# Altium schematic sheet NTC.SchDoc
size 420 x 297 mm; SheetNumber: 20; SheetTotal: 27
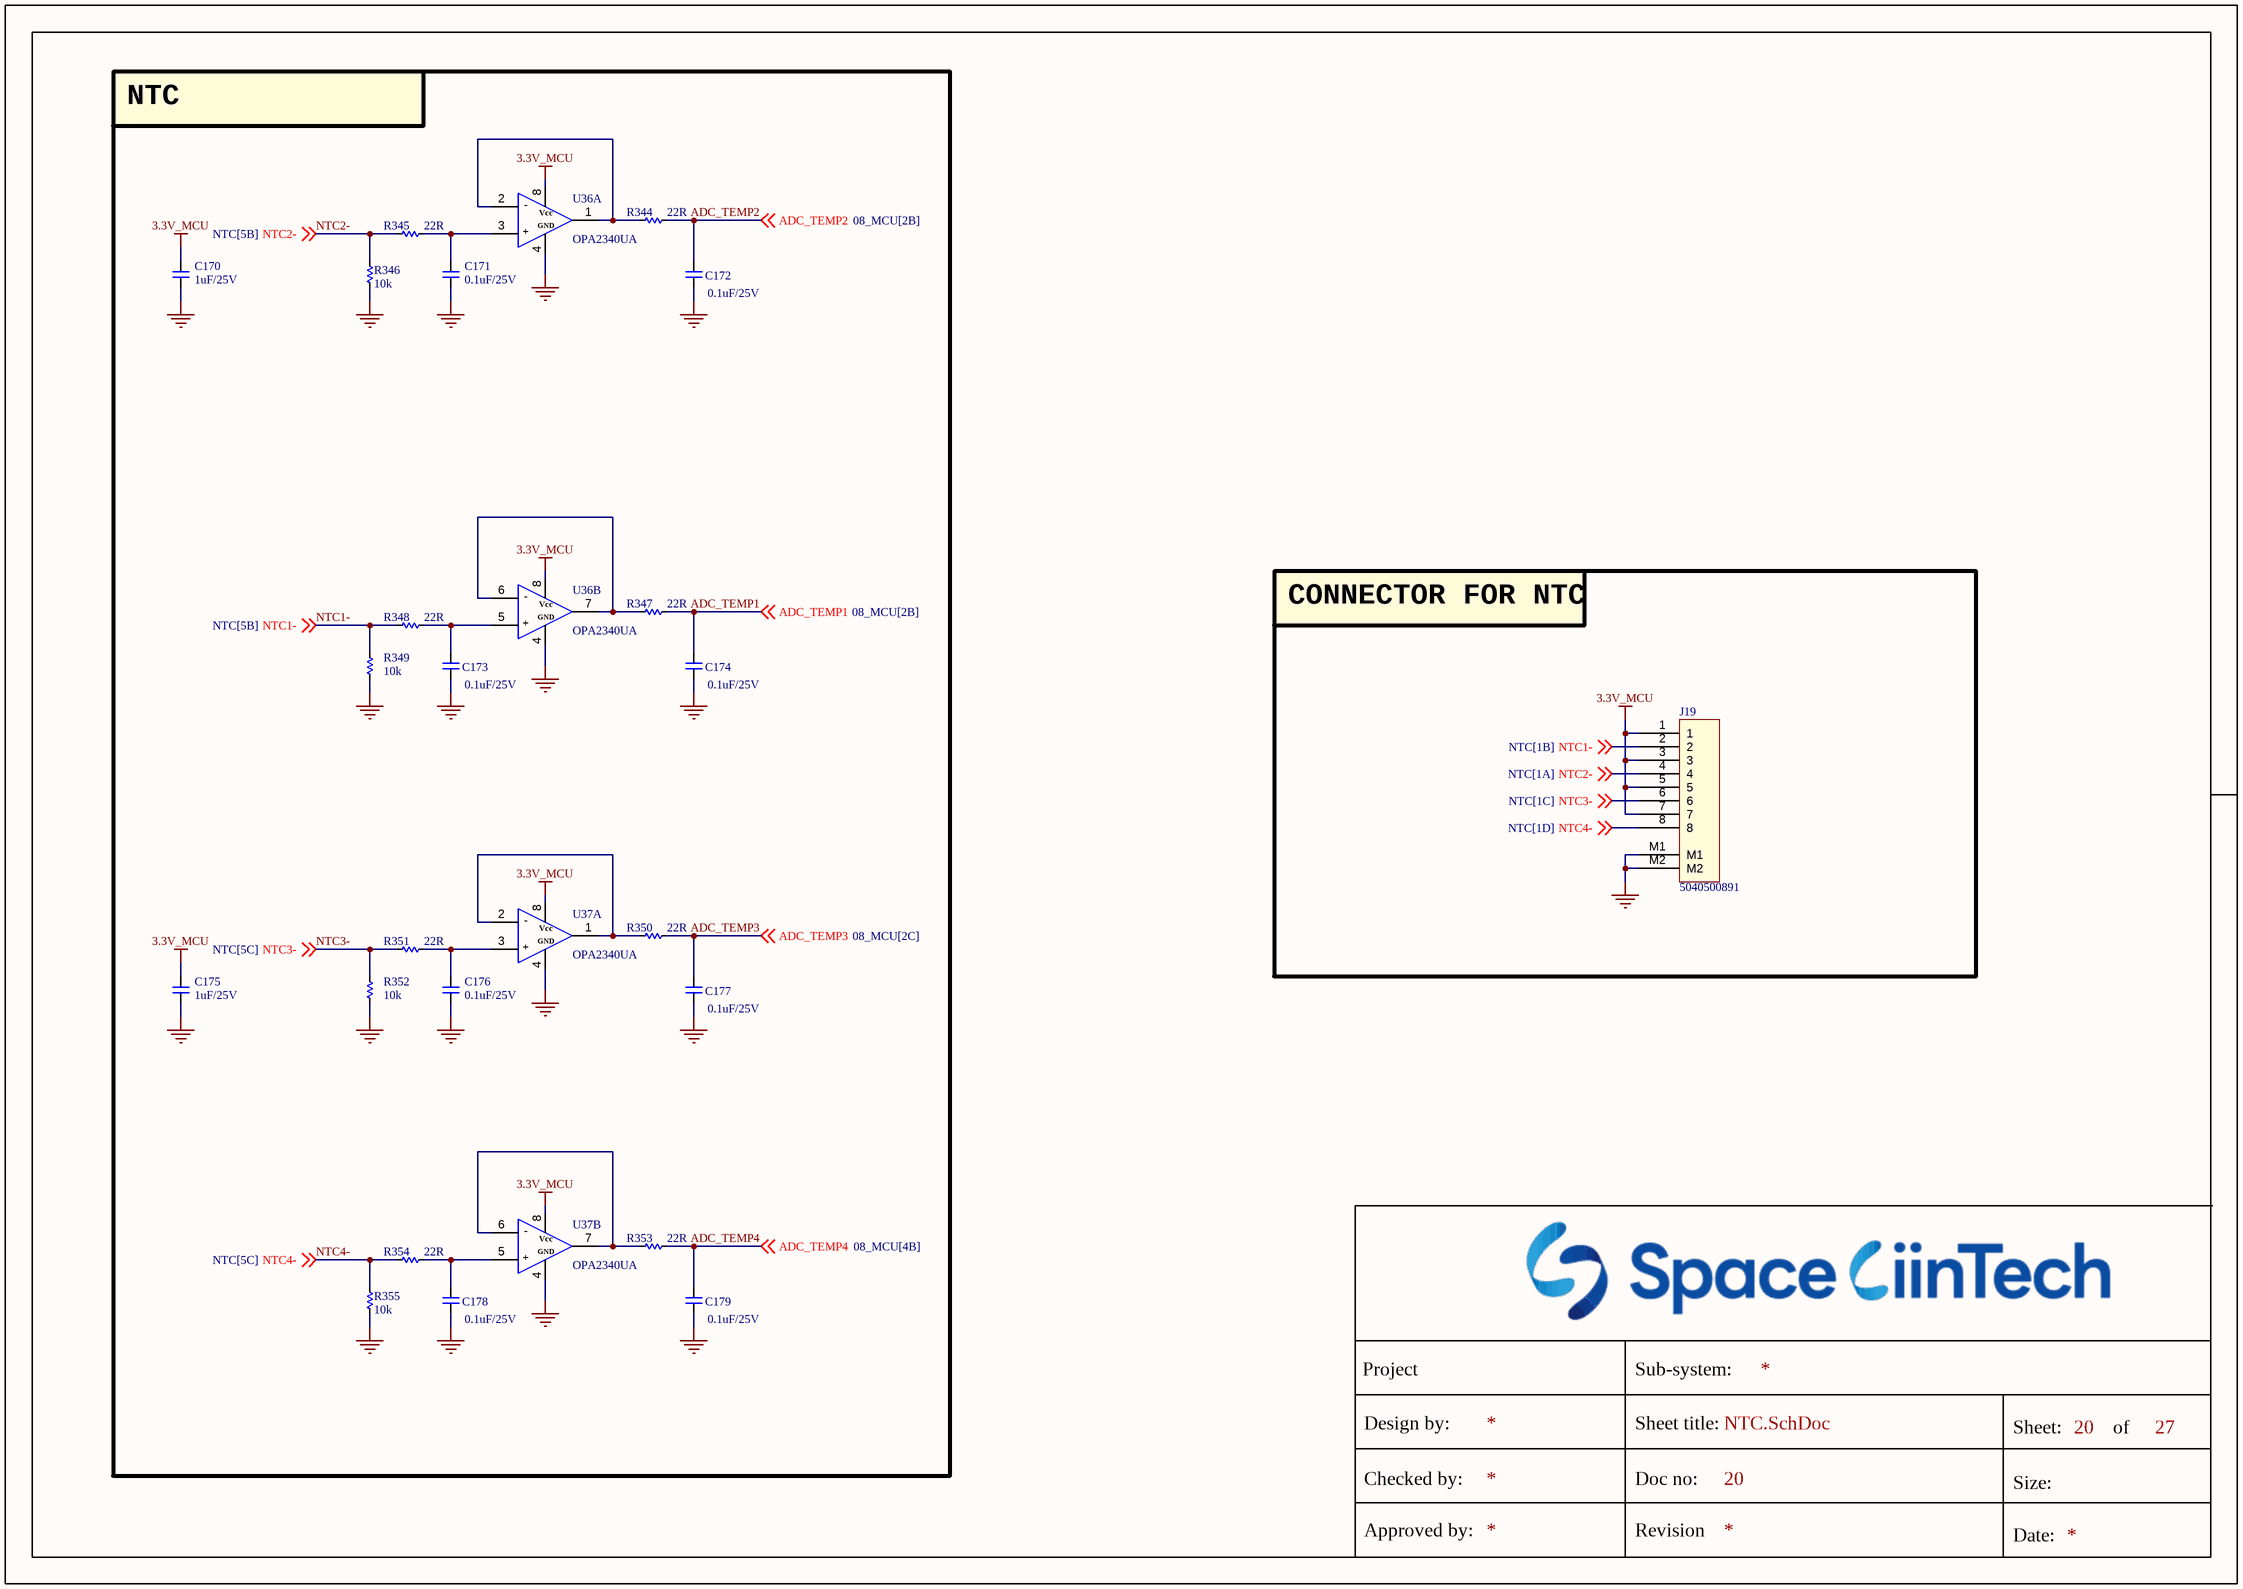
[diagram p0: NTC.SchDoc]

## Parts
C170  1uF/25V  [CAP_C_1005X60]
C171  0.1uF/25V  [CAP_C_1005X60]
C172  0.1uF/25V  [CAP_C_1005X60]
C173  0.1uF/25V  [CAP_C_1005X60]
C174  0.1uF/25V  [CAP_C_1005X60]
C175  1uF/25V  [CAP_C_1005X60]
C176  0.1uF/25V  [CAP_C_1005X60]
C177  0.1uF/25V  [CAP_C_1005X60]
C178  0.1uF/25V  [CAP_C_1005X60]
C179  0.1uF/25V  [CAP_C_1005X60]
J19  5040500891  [MOLEX_5040500891]
R344  22R  [RES_C_1005X40]
R345  22R  [RES_C_1005X40]
R346  10k  [RES_C_1005X40]
R347  22R  [RES_C_1005X40]
R348  22R  [RES_C_1005X40]
R349  10k  [RES_C_1005X40]
R350  22R  [RES_C_1005X40]
R351  22R  [RES_C_1005X40]
R352  10k  [RES_C_1005X40]
R353  22R  [RES_C_1005X40]
R354  22R  [RES_C_1005X40]
R355  10k  [RES_C_1005X40]
U36  OPA2340UA  [SOIC127P602X173-8N]  (parts A,B of 2)
U37  OPA2340UA  [SOIC127P602X173-8N]  (parts A,B of 2)

## Blocks framed on the sheet
NTC: C170-C179 R344-R355 U36 U37
CONNECTOR FOR NTC: J19

## Nets
3.3V_MCU: C170.2 C175.2 J19.1 J19.3 J19.5 J19.7 U36.8 U37.8
GND: C170.1 C171.1 C172.1 C173.1 C174.1 C175.1 C176.1 C177.1 C178.1 C179.1 J19.M1 J19.M2 R346.1 R349.1 R352.1 R355.1 U36.4 U37.4
ADC_TEMP1: C174.2 R347.2 ; off-sheet ADC_TEMP1
ADC_TEMP2: C172.2 R344.2 ; off-sheet ADC_TEMP2
ADC_TEMP3: C177.2 R350.2 ; off-sheet ADC_TEMP3
ADC_TEMP4: C179.2 R353.2 ; off-sheet ADC_TEMP4
NTC1-: J19.2 R348.1 R349.2 ; off-sheet NTC1-
NTC2-: J19.4 R345.1 R346.2 ; off-sheet NTC2-
NTC3-: J19.6 R351.1 R352.2 ; off-sheet NTC3-
NTC4-: J19.8 R354.1 R355.2 ; off-sheet NTC4-
NetC171_2: C171.2 R345.2 U36.3
NetC173_2: C173.2 R348.2 U36.5
NetC176_2: C176.2 R351.2 U37.3
NetC178_2: C178.2 R354.2 U37.5
NetR344_1: R344.1 U36.1 U36.2
NetR347_1: R347.1 U36.6 U36.7
NetR350_1: R350.1 U37.1 U37.2
NetR353_1: R353.1 U37.6 U37.7

## Notes on the sheet
- Project
- Sub-system:
- Design by:
- Sheet title:
- Sheet:
- of
- Checked by:
- Approved by:
- Doc no:
- Revision
- Size:
- Date:
- (in symbol OPA2340UA, part A) -; Vcc; GND; +
- (in symbol OPA2340UA, part B) -; Vcc; GND; +

## Library data of the parts
C170-C179 = _CAP_C_2: CAP
J19 = Header 8x1_2M
R344-R355 = _RES_B_2: RES